# Altium project RFID_PCB_Antenna.PrjPcb
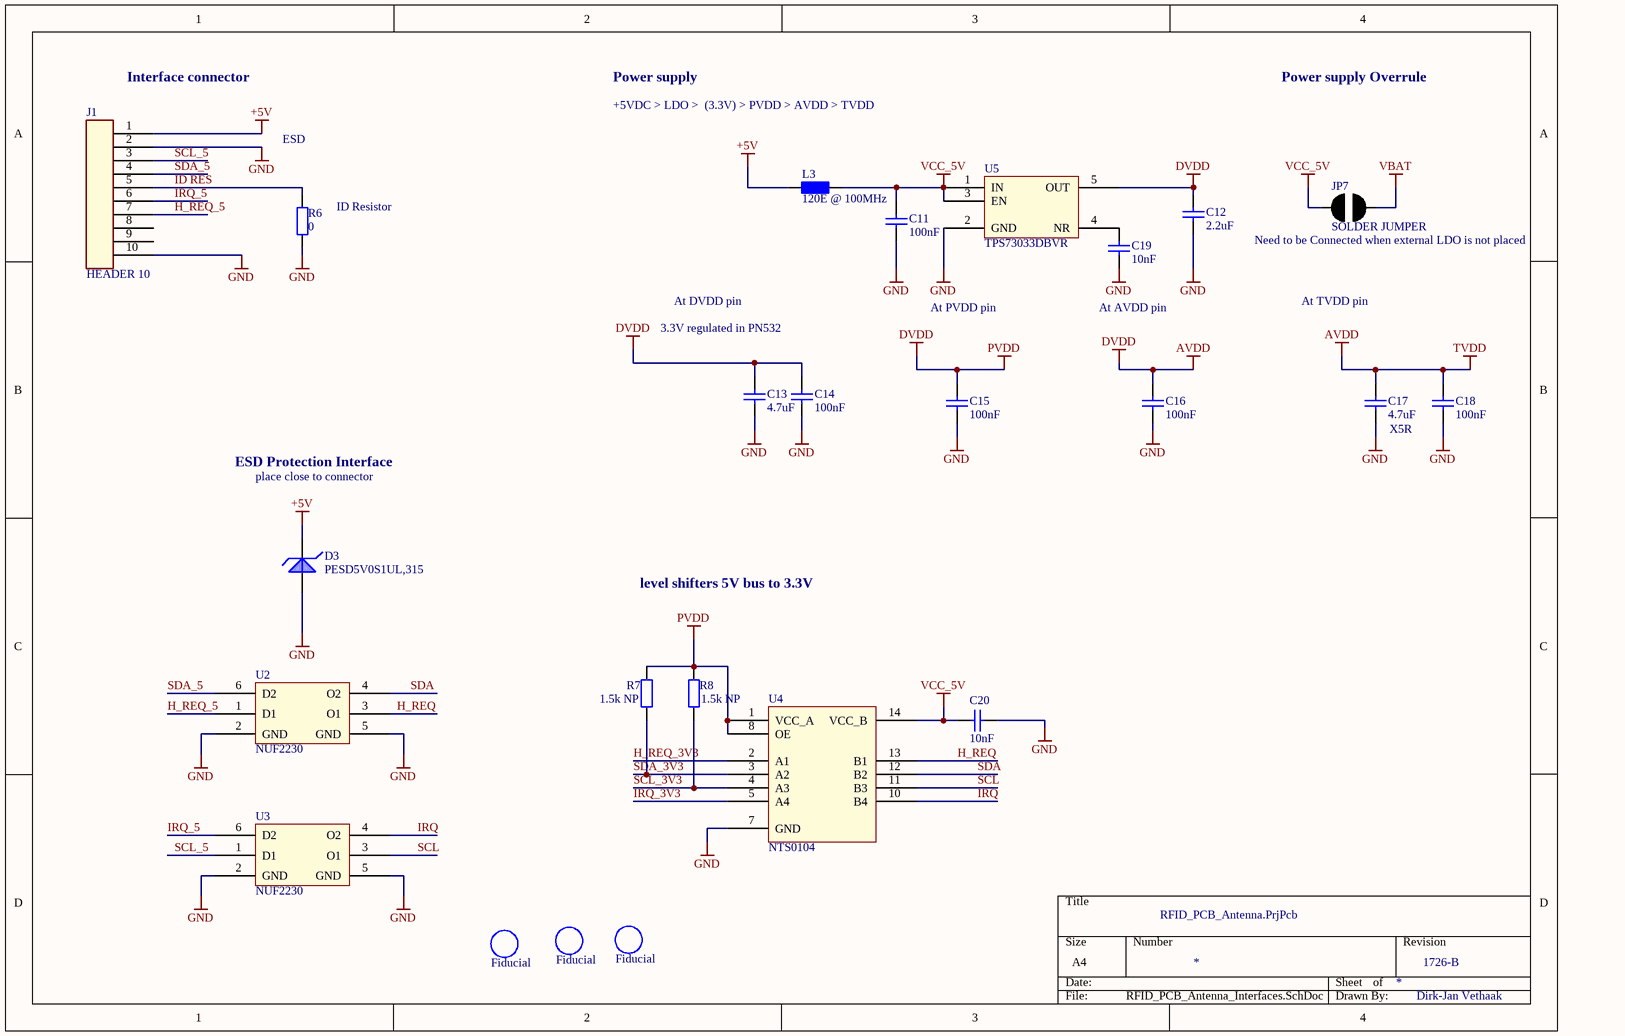
[diagram p0: RFID_PCB_Antenna_Interfaces.SchDoc]
Rev: 1726-B; Sub-Rev: 03; Title: RFID_PCB_Antenna
3 sheets, 65 parts. Net scope: global (net labels, ports and power ports of the same name join across sheets).
Board file: RFID_PCB_Antenna.PcbDoc
Sheets:
  RFID_PCB_Antenna_Interfaces.SchDoc
  RFID_PCB_Antenna_Main_circuit.SchDoc
  RFID_PCB_Antenna_Revisions.SchDoc

## Sheet RFID_PCB_Antenna_Interfaces.SchDoc: RFID_PCB_Antenna
size A4

### Parts
C11  100nF  [cap0402]
C12  2.2uF  [cap0402]
C13  4.7uF  [cap0402]
C14  100nF  [cap0402]
C15  100nF  [cap0402]
C16  100nF  [cap0402]
C17  4.7uF  [cap0402]
C18  100nF  [cap0402]
C19  10nF  [cap0402]
C20  10nF  [cap0402]
D3  Manufacturer Part Number: PESD5V0S1UL,315  [DFN65P100X50-2N]  (hidden comment: PESD5V0S1UL)
Fid1  Fiducial  [Fiducial]  (no BOM)
Fid2  Fiducial  [Fiducial]  (no BOM)
Fid3  Fiducial  [Fiducial]  (no BOM)
J1  HEADER 10  [HEADER-2X5P-ST-2]
JP7  SOLDER JUMPER  [Jumper Solder 0402]
L3  120E @ 100MHz  [R0603]
R6  0  [RESC1105X04N]
R7  1.5k NP  [RESC1105X04N]
R8  1.5k NP  [RESC1105X04N]
U2  NUF2230  [SOTFL50P160X60-6N]
U3  NUF2230  [SOTFL50P160X60-6N]
U4  NTS0104  [QFN50P300X250X100_HS-15N]
U5  TPS73033DBVR  [SOT95P280X145-5N]

### Nets
+5V: D3.1(K) J1.1 L3.1
AVDD: C12.2 C13.2 C14.2 C15.2 C16.2 C17.2 C18.2 R7.2 R8.2 U4.1(VCC_A) U4.8(OE) U5.5(OUT)  [also labelled DVDD, PVDD, TVDD]
GND: C11.1 C12.1 C13.1 C14.1 C15.1 C16.1 C17.1 C18.1 C19.2 C20.1 D3.2(A) J1.2 J1.10 R6.1 U2.2(GND) U2.5(GND) U3.2(GND) U3.5(GND) U4.7(GND) U5.2(GND)
VBAT: JP7.2
VCC_5V: C11.2 C20.2 JP7.1 L3.2 U4.14(VCC_B) U5.1(IN) U5.3(EN)
H_REQ: U2.3(O1) U4.13(B1)
H_REQ_3V3: U4.2(A1)
H_REQ_5: J1.7 U2.1(D1)
ID RES: J1.5 R6.2
IRQ: U3.4(O2) U4.10(B4)
IRQ_3V3: U4.5(A4)
IRQ_5: J1.6 U3.6(D2)
SCL: U3.3(O1) U4.11(B3)
SCL_3V3: R8.1 U4.4(A3)
SCL_5: J1.3 U3.1(D1)
SDA: U2.4(O2) U4.12(B2)
SDA_3V3: R7.1 U4.3(A2)
SDA_5: J1.4 U2.6(D2)
NetC19_1: C19.1 U5.4(NR)

Not connected (* = marked no-connect by the designer): J1 8 9; U4 6(NC) 9(NC)

### Notes on the sheet
- (near J1) Interface connector
- +5VDC > LDO >  (3.3V) > PVDD > AVDD > TVDD
- Power supply
- Power supply Overrule
- ESD
- (near R6) ID Resistor
- (near JP7) Need to be Connected when external LDO is not placed
- At DVDD pin
- At PVDD pin
- (near C19) At AVDD pin
- At TVDD pin
- 3.3V regulated in PN532
- (near C17) X5R
- ESD Protection Interface
- place close to connector
- level shifters 5V bus to 3.3V
- Dirk-Jan Vethaak

### Library data of the parts
C11 C14-C16 C18 = C0402: Manufacturer: Vishay / Vitramon; Manufacturer Part Number: VJ0402G104KXQCW1BC; Capacitance: 0.1 uF; Tolerance: 10 %; Type: Ultra Small Commodity MLCCs; Voltage Rating DC: 10 VDC; Dielectric: X5R; Qualification: Commercial; Supplier 1: Mouser; Supplier Part Number 1: 77-VJ0402G104KXQCBC; RoHS: RoHS Compliant; Category: Multilayer Ceramic Capacitors MLCC - SMD/SMT; Stock 1: 26687; Pricing 1: 1=0.100, 50=0.080, 100=0.066, 500=0.047, 1000=0.028, 10000=0.021, 20000=0.019, 50000=0.012, 100000=0.010 (USD); Height: 0.55 mm; Length: 1 mm; Package / Case: 0402 (1005 metric); Packaging: Reel; Product: General Type MLCCs; Series: VJ W1BC; Termination Style: SMD/SMT; Voltage Rating AC: -; Width: 0.5 mm; Brand: Vishay / Vitramon; Case Code - in: 0402; Case Code - mm: 1005; Maximum Operating Temperature: + 85 C; Minimum Operating Temperature: - 55 C; Product Category: Ceramic Chip Capacitors; RoHS - Mouser: Y; Minimum Order Quantity: 1; Reeling: True; ComponentLink1URL: http://www.mouser.com/ds/2/427/vjw1bcbascomseries-223529.pdf; ComponentLink1Description: http://www.mouser.com/ds/2/427/vjw1bcbascomseries-223529.pdf
C12 = C0402: Manufacturer: Murata Electronics; Manufacturer Part Number: GRM155R61A225KE95D; Tolerance: 10 %; Type: Voltage and Temperature Derating Recommended Product; Voltage Rating DC: 10 VDC; Dielectric: X5R; Product Status: New Product; Supplier 1: Mouser; Supplier Part Number 1: 81-GRM155R61A225KE5D; RoHS: RoHS Compliant; Category: Multilayer Ceramic Capacitors MLCC - SMD/SMT; Stock 1: 204336; Pricing 1: 1=0.120, 10=0.047, 100=0.028, 1000=0.022, 2500=0.018, 10000=0.016, 20000=0.014, 50000=0.013, 100000=0.010 (USD); Capacitance: 2.2 uF; Height: 0.5 mm; Length: 1 mm; Package / Case: 0402 (1005 metric); Packaging: Reel; Product: General Type MLCCs; Series: GRM; Termination Style: SMD/SMT; Width: 0.5 mm; Brand: Murata Electronics; Case Code - in: 0402; Case Code - mm: 1005; Maximum Operating Temperature: + 85 C; Minimum Operating Temperature: - 55 C; RoHS - Mouser: Y; Minimum Order Quantity: 1; Reeling: True; ComponentLink1URL: http://www.mouser.com/ds/2/281/c02e-2905.pdf; ComponentLink1Description: http://www.mouser.com/ds/2/281/c02e-2905.pdf
C13 C17 = C0402: Manufacturer: Murata Electronics; Manufacturer Part Number: GRM155R60J475ME87D; Tolerance: 20 %; Type: Voltage and Temperature Derating Recommended Product; Voltage Rating DC: 6.3 VDC; Dielectric: X5R; Product Status: New at Mouser; Supplier 1: Mouser; Supplier Part Number 1: 81-GRM155R60J475ME8D; RoHS: RoHS Compliant; Category: Multilayer Ceramic Capacitors MLCC - SMD/SMT; Stock 1: 373257; Pricing 1: 1=0.140, 10=0.056, 100=0.033, 1000=0.027, 2500=0.023, 10000=0.020, 20000=0.018, 50000=0.017, 100000=0.014 (USD); Capacitance: 4.7 uF; Height: 0.5 mm; Length: 1 mm; Package / Case: 0402 (1005 metric); Packaging: Reel; Product: General Type MLCCs; Series: GRM15; Termination Style: SMD/SMT; Width: 0.5 mm; Brand: Murata Electronics; Case Code - in: 0402; Case Code - mm: 1005; Maximum Operating Temperature: + 85 C; Minimum Operating Temperature: - 55 C; RoHS - Mouser: Y; Minimum Order Quantity: 1; Reeling: True; ComponentLink1URL: http://www.mouser.com/ds/2/281/c02e-2905.pdf; ComponentLink1Description: http://www.mouser.com/ds/2/281/c02e-2905.pdf
C19 C20 = C0402: Manufacturer: Vishay / Vitramon; Manufacturer Part Number: VJ0402Y103KXJCW1BC; Capacitance: 0.01 uF; Tolerance: 10 %; Type: Ultra Small Commodity MLCCs; Voltage Rating DC: 16 VDC; Dielectric: X7R; Qualification: Commercial; Supplier 1: Mouser; Supplier Part Number 1: 77-VJ0402Y103KXJCBC; RoHS: RoHS Compliant; Category: Multilayer Ceramic Capacitors MLCC - SMD/SMT; Stock 1: 46396; Pricing 1: 1=0.060, 50=0.050, 100=0.040, 500=0.030, 1000=0.025, 10000=0.007, 20000=0.006, 50000=0.005, 100000=0.004 (USD); Height: 0.55 mm; Length: 1 mm; Package / Case: 0402 (1005 metric); Packaging: Reel; Product: General Type MLCCs; Series: VJ W1BC; Termination Style: SMD/SMT; Voltage Rating AC: -; Width: 0.5 mm; Brand: Vishay / Vitramon; Case Code - in: 0402; Case Code - mm: 1005; Maximum Operating Temperature: + 125 C; Minimum Operating Temperature: - 55 C; Product Category: Ceramic Chip Capacitors; RoHS - Mouser: Y; Minimum Order Quantity: 1; Reeling: True; ComponentLink1URL: http://www.mouser.com/ds/2/427/vjw1bcbascomseries-223529.pdf; ComponentLink1Description: http://www.mouser.com/ds/2/427/vjw1bcbascomseries-223529.pdf
D3 = TVS Diode: TVS DIODE 5VWM 20VC SOD882; Manufacturer: NXP Semiconductors; Type: Zener; Unidirectional Channels: 1; Voltage - Reverse Standoff (Typ): 5V (Max); Voltage - Breakdown (Min): 6.4V; Voltage - Clamping (Max) @ Ipp: 20V; Current - Peak Pulse (10/1000µs): 15A (8/20µs); Power - Peak Pulse: 150W; Power Line Protection: No; Capacitance @ Frequency: 152pF @ 1MHz; Supplier 1: Digi-Key; RoHS: RoHS Compliant; Category: Circuit Protection; Stock 1: 10194; Pricing 1: 1=0.37, 10=0.278, 100=0.1732, 500=0.11838, 1000=0.091 (EUR); Packaging: Cut Tape (CT); Bidirectional Channels: -; Applications: Automotive; Operating Temperature: -65°C ~ 150°C (TA); Mounting Type: Surface Mount; Package / Case: SOD-882; Supplier Device Package: SOD-882; ComponentLink1URL: http://www.nxp.com/documents/data_sheet/PESDXS1UL_SER.pdf; ComponentLink1Description: http://www.nxp.com/documents/data_sheet/PESDXS1UL_SER.pdf; Supplier Part Number 1: 568-4802-1-ND
Fid1-Fid3 = Fiducial: ID: Library_MISC-0003; Faber ItemCode: -; Mfg: -; Mfg code: -; Value: Fiducial
J1 = HEADER 10: B10B-PHDSS(LF)(SN); Manufacturer: JST Sales America Inc.; Connector Type: Header, Shrouded; Number of Positions: 10; Number of Positions Loaded: All; Pitch: 0.079" (2.00mm); Supplier 1: Digi-Key; Manufacturer Part Number: B10B-PHDSS(LF)(SN); RoHS: RoHS Compliant; Category: Connectors, Interconnects; Stock 1: 19877; Pricing 1: 1=0.44, 10=0.418, 100=0.2924, 500=0.25058, 1000=0.20882, 5000=0.17899, 10000=0.16706 (EUR); Packaging: Bulk; Contact Type: Male Pin; Number of Rows: 2; Row Spacing: 0.079" (2.00mm); Contact Mating Length: 0.114" (2.90mm); Mounting Type: Through Hole; Termination: Solder; Fastening Type: Detent Lock; Features: -; Contact Finish: Tin; Contact Finish Thickness: -; Color: Natural; ComponentLink1URL: http://www.jst-mfg.com/product/pdf/eng/ePHD.pdf; ComponentLink1Description: http://www.jst-mfg.com/product/pdf/eng/ePHD.pdf; Supplier Part Number 1: 455-1762-ND
JP7 = JUMPER 2 SOLDER: ID: Library_CON-0010; Mfg: -; Mfg code: -; Value: SOLDER JUMPER
L3 = Ferriet Bead 120E: FERRIET BLM18PG121SN1D 0603 MURATA; Manufacturer: Murata Electronics North America; Info: Resistor; Filter Type: Power Line; Number of Lines: 1; Impedance @ Frequency: 120 Ohm @ 100MHz; Current Rating (Max): 2A; DC Resistance (DCR) (Max): 50 mOhm; ID: -; Faber ItemCode: -; Value: 120E @ 100MHz; Mfg: Murata; Mfg code: BLM18PG121SN1D; Supplier 1: Farnell; Supplier 2: Digi-Key; Manufacturer Part Number: BLM18PG121SN1D; RoHS: RoHS Compliant; Category: Filters; Stock 2: 360000; Pricing 2: 4000=0.02022, 8000=0.01832, 12000=0.01769, 28000=0.01642, 100000=0.01623 (EUR); Packaging: Tape & Reel (TR); Ratings: -; Operating Temperature: -55°C ~ 125°C; Package / Case: 0603 (1608 Metric); Mounting Type: Surface Mount; Height (Max): 0.037" (0.95mm); Size / Dimension: 0.063" L x 0.031" W (1.60mm x 0.80mm); ComponentLink1URL: http://search.murata.co.jp/Ceramy/image/img/PDF/ENG/L0110S0100BLM18P.pdf; ComponentLink1Description: http://search.murata.co.jp/Ceramy/image/img/PDF/ENG/L0110S0100BLM18P.pdf; Supplier Part Number 1: 1515738; Supplier Part Number 2: 490-1037-2-ND
R6 = R0402: Manufacturer: VISHAY; Manufacturer Part Number: CRCW04020000Z0ED; Product Range: AEC-Q200 CRCW Series; Voltage Rating: 50; Resistor Case Style: 0402 [1005 Metric]; Power Rating: 63; Resistor Element Material: Thick Film; Temperature Coefficient: ± 100; Resistor Mounting: Surface Mount Device<!--FANDB--><div class="features-and-benefits-container"><div class="features-and-benefits-description"><span class="features-benefits-value">The Vishay D/CRCW e3 series are standard thick film chip resistors. The resistance range includes E96 and E24 decade values from 1ohm to 10Mohm. CRCW e3 series resistors have a pure tin solder contacts on the Ni barrier layer that provides compatibility with reflow soldering process.</span></div><div class="features-and-benefits-list"><ul class="features-and-benefits-list-list"><li class="features-and-benefits-list-item">Automotive grade AEC-Q200 qualified</li><li class="features-and-benefits-list-item">EIA 0402, 0603, 0805, 1206, 1210, 1218, 2010, 2512 standard case sizes available</li><li class="features-and-benefits-list-item">Stability &Delta; Supplier 1: Farnell; Supplier Part Number 1: 1469661; RoHS: Y-EX; Stock 1: 83830; Pricing 1: 10=0.0078, 300=0.0062, 1000=0.0045, 2500=0.0039, 5000=0.0031 (GBP); Resistance: 0; Resistance Tolerance: -; Packaging: Cut Tape; MSL: MSL 1 - Unlimited; ComponentLink1URL: http://www.farnell.com/datasheets/2045673.pdf; ComponentLink1Description: http://www.farnell.com/datasheets/2045673.pdf; ComponentLink2URL: http://www.farnell.com/cad/1551206.zip; ComponentLink2Description: http://www.farnell.com/cad/1551206.zip
R7 R8 = R0402: Manufacturer: Vishay Dale; Manufacturer Part Number: CRCW04021K50JNED; Tolerance: ±5%; Power (Watts): 0.063W, 1/16W; Temperature Coefficient: ±200ppm/°C; Supplier 1: Digi-Key; Supplier Part Number 1: 541-1.5KJCT-ND; RoHS: RoHS Compliant; Category: Resistors; Stock 1: 23738; Pricing 1: 1=0.09, 10=0.019, 25=0.014, 50=0.011, 100=0.008, 250=0.00612, 500=0.0049, 1000=0.0036, 2500=0.00313 (EUR); Packaging: Cut Tape (CT); Resistance (Ohms): 1.5k; Composition: Thick Film; Features: Automotive AEC-Q200; Operating Temperature: -55°C ~ 155°C; Package / Case: 0402 (1005 Metric); Supplier Device Package: 0402 (1005 Metric); Size / Dimension: 0.039" L x 0.020" W (1.00mm x 0.50mm); Height: 0.016" (0.40mm); Number of Terminations: 2; ComponentLink1URL: http://www.vishay.com/docs/20035/dcrcwe3.pdf; ComponentLink1Description: http://www.vishay.com/docs/20035/dcrcwe3.pdf
U2 U3 = NUF2230: NUF2230XV6T1G; Mfg: ON Semiconductor; Filter Order: 2nd; Number of Channels: 2; Center / Cutoff Frequency: 125MHz (Cutoff); Attenuation Value: 30dB @ 800MHz ~ 900MHz; Resistance - Channel (Ohms): 100; Values: R = 100 Ohms, C = 16pF; ESD Protection: Yes; Supplier 1: Digi-Key; Supplier Part Number 1: NUF2230XV6T1GOSCT-ND; Mfg code: NUF2230XV6T1G; RoHS: RoHS Compliant; Category: Filters; Stock: 3048; Pricing: 1=0.27, 10=0.252, 25=0.2404, 50=0.2326, 100=0.2248, 250=0.21316, 500=0.17828, 1000=0.13836 (EUR); Packaging: Cut Tape (CT); Type: Low Pass; Technology: RC (Pi); Current: -; Operating Temperature: -40°C ~ 85°C; Applications: Data Lines for Mobile Devices; Package / Case: SOT-563, SOT-666; Size / Dimension: 0.063" L x 0.047" W (1.60mm x 1.20mm); Height: 0.024" (0.60mm); ComponentLink1URL: http://www.onsemi.com/pub_link/Collateral/NUF2230XV6-D.PDF; ComponentLink1Description: http://www.onsemi.com/pub_link/Collateral/NUF2230XV6-D.PDF; Manufacturer Part Number: NUF2230XV6T1G; Manufacturer: ON Semiconductor
U4 = NTS0104: NTS0104BQ,115, DHVQFN14; Manufacturer: NXP Semiconductors; Translator Type: Voltage Level; Channel Type: Bidirectional; Number of Circuits: 1; Channels per Circuit: 4; Voltage - VCCA: 1.65 V ~ 3.6 V; Voltage - VCCB: 2.3 V ~ 5.5 V; Output Type: Open Drain, Push-Pull; Data Rate: 50Mbps; Supplier 1: Digi-Key; Manufacturer Part Number: NTS0104BQ,115; RoHS: RoHS Compliant; Category: Integrated Circuits (ICs); Stock 1: 6000; Pricing 1: 3000=0.33105, 6000=0.3145, 15000=0.30267, 30000=0.29322, 75000=0.28376 (EUR); Packaging: Tape & Reel (TR); Input Signal: -; Output Signal: -; Operating Temperature: -40°C ~ 125°C (TA); Features: Auto-Direction Sensing; Mounting Type: Surface Mount; Package / Case: 14-VFQFN Exposed Pad; Supplier Device Package: 14-DHVQFN (2.5x3); ComponentLink1URL: http://www.nxp.com/documents/data_sheet/NTS0104.pdf; ComponentLink1Description: http://www.nxp.com/documents/data_sheet/NTS0104.pdf; Supplier Part Number 1: 568-8407-2-ND
U5 = TPS73033DBVR: LDO 3.3V; Manufacturer: Texas Instruments; Regulator Topology: Positive Fixed; Current - Output: 200mA; Voltage - Dropout (Typical): 0.12V @ 200mA; Number of Regulators: 1; Voltage - Input: Up to 5.5V; Current - Limit (Min): 285mA; Supplier 1: Digi-Key; Manufacturer Part Number: TPS73033DBVR; RoHS: RoHS Compliant; Category: Integrated Circuits (ICs); Stock 1: 21892; Pricing 1: 1=0.6, 10=0.528, 100=0.4043, 500=0.32032, 1000=0.25657 (EUR); Packaging: Cut Tape (CT); Voltage - Output: 3.3V; Operating Temperature: -40°C ~ 125°C; Mounting Type: Surface Mount; Package / Case: SC-74A, SOT-753; Supplier Device Package: SOT-23-5; ComponentLink1URL: http://www.ti.com/lit/ds/symlink/tps730.pdf; ComponentLink1Description: http://www.ti.com/lit/ds/symlink/tps730.pdf

## Sheet RFID_PCB_Antenna_Main_circuit.SchDoc: RFID_PCB_Antenna
size A4; PageSetup: Record=PageOptions|CenterHorizontal=True|CenterVertical=True|PrintScale=0.97|XCorrection=1.00|YCorrection=1.00|PrintKind=0|BorderSize=5000000|LeftOffset=0|BottomOffset=0|Orientation=2|PaperLength=1000|PaperWidth=1000|Scale=100|PaperSource=15|PrintQuality=-3|MediaType=1|DitherType=10|PrintScaleMode=1|PaperKind=A4|PaperIndex=9
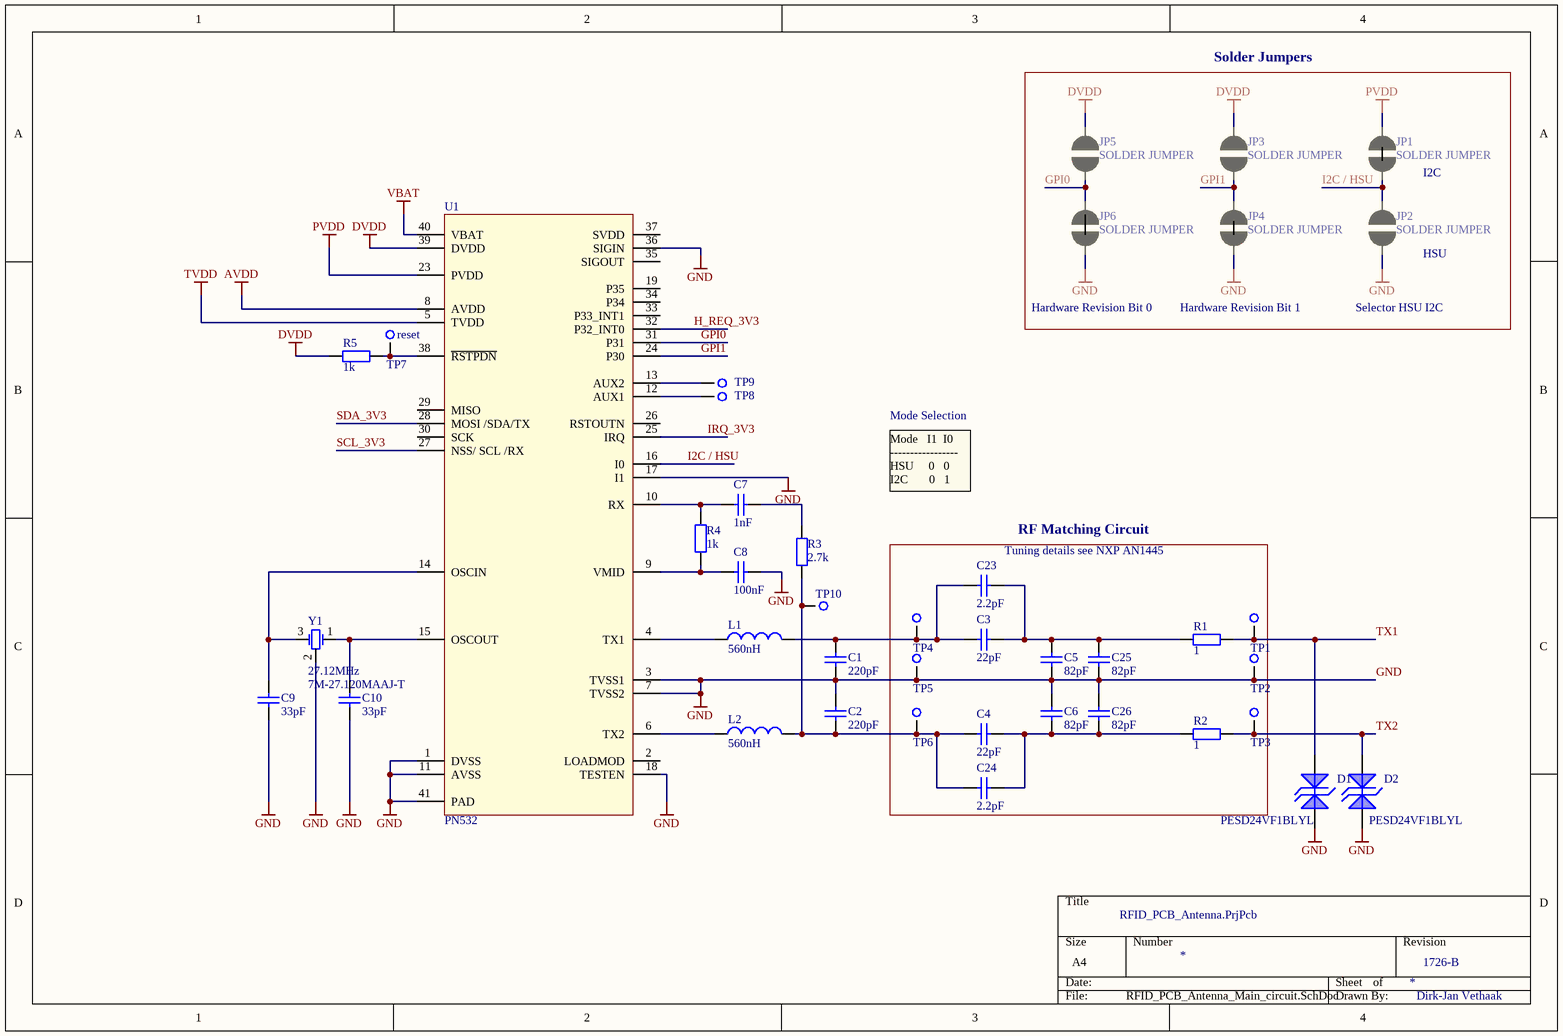
[diagram p1: RFID_PCB_Antenna_Main_circuit.SchDoc]

### Parts
C1  220pF  [cap0402]
C2  220pF  [cap0402]
C3  22pF  [cap0402]
C4  22pF  [cap0402]
C5  82pF  [cap0402]
C6  82pF  [cap0402]
C7  1nF  [cap0402]
C8  100nF  [cap0402]
C9  33pF  [cap0402]
C10  33pF  [cap0402]
C23  2.2pF  [cap0402]
C24  2.2pF  [cap0402]
C25  82pF  [cap0402]
C26  82pF  [cap0402]
D1  Manufacturer Part Number: PESD24VF1BLYL  [DFN65P100X50-2N]  (hidden comment: PESD24VF1BL)
D2  Manufacturer Part Number: PESD24VF1BLYL  [DFN65P100X50-2N]  (hidden comment: PESD24VF1BL)
JP1  SOLDER JUMPER  [Jumper Solder 0402]
JP2  SOLDER JUMPER  [Jumper Solder 0402]
JP3  SOLDER JUMPER  [Jumper Solder 0402]
JP4  SOLDER JUMPER  [Jumper Solder 0402]
JP5  SOLDER JUMPER  [Jumper Solder 0402]
JP6  SOLDER JUMPER  [Jumper Solder 0402]
L1  560nH  [C0603]
L2  560nH  [C0603]
R1  1  [RESC1105X04N]
R2  1  [RESC1105X04N]
R3  2.7k  [RESC1105X04N]
R4  1k  [RESC1105X04N]
R5  1k  [RESC1105X04N]
TP1  Testpoint  [Testpoint]  (value not drawn)
TP2  Testpoint  [Testpoint]  (value not drawn)
TP3  Testpoint  [Testpoint]  (value not drawn)
TP4  Testpoint  [Testpoint]  (value not drawn)
TP5  Testpoint  [Testpoint]  (value not drawn)
TP6  Testpoint  [Testpoint]  (value not drawn)
TP7  Testpoint  [TESTPOINT]  (value not drawn)
TP8  Testpoint  [Testpoint]  (value not drawn)
TP9  Testpoint  [Testpoint]  (value not drawn)
TP10  Testpoint  [Testpoint]  (value not drawn)
U1  PN532  [QFN50P600X600X100_HS-41N]
Y1  27.12MHz  [DFN170P250X71-4N]

### Blocks framed on the sheet
Solder Jumpers: JP1-JP6
RF Matching Circuit: C3-C6 C23-C26 R1 R2 TP1-TP6

### Nets
AVDD: JP1.2 JP3.2 JP5.2 R5.2 U1.5(TVDD) U1.8(AVDD) U1.23(PVDD) U1.39(DVDD)  [also labelled DVDD, PVDD, TVDD]
GND: C1.1 C2.2 C5.1 C6.2 C8.1 C9.1 C10.1 C25.1 C26.2 D1.1(K1) D2.1(K1) JP2.1 JP4.1 JP6.1 TP2.1 TP5.1 U1.1(DVSS) U1.3(TVSS1) U1.7(TVSS2) U1.11(AVSS) U1.17(I1) U1.18(TESTEN) U1.36(SIGIN) U1.41(PAD) Y1.2
VBAT: U1.40(VBAT)
GPI0: JP5.1 JP6.2 U1.31(P31)
GPI1: JP3.1 JP4.2 U1.24(P30)
H_REQ_3V3: U1.32(P32_INT0)
I2C / HSU: JP1.1 JP2.2 U1.16(I0)
IRQ_3V3: U1.25(IRQ)
SCL_3V3: U1.27(NSS/_SCL_/RX)
SDA_3V3: U1.28(MOSI_/SDA/TX)
TX1: D1.2(K2) R1.2 TP1.1
TX2: D2.2(K2) R2.2 TP3.1
NetC1_2: C1.2 C3.1 C23.1 L1.2 TP4.1
NetC2_1: C2.1 C4.1 C24.1 L2.2 R3.1 TP6.1 TP10.1
NetC3_2: C3.2 C5.2 C23.2 C25.2 R1.1
NetC4_2: C4.2 C6.1 C24.2 C26.1 R2.1
NetC7_1: C7.1 R4.2 U1.10(RX)
NetC7_2: C7.2 R3.2
NetC8_2: C8.2 R4.1 U1.9(VMID)
NetC9_2: C9.2 U1.14(OSCIN) Y1.3
NetC10_2: C10.2 U1.15(OSCOUT) Y1.1
NetL1_1: L1.1 U1.4(TX1)
NetL2_1: L2.1 U1.6(TX2)
NetR5_1: R5.1 TP7.1 U1.38(~{RSTPDN})
NetTP8_1: TP8.1 U1.12(AUX1)
NetTP9_1: TP9.1 U1.13(AUX2)

Not connected (* = marked no-connect by the designer): U1 2(LOADMOD) 19(P35) 20(NC) 21(NC) 22(NC) 26(RSTOUTN) 29(MISO) 30(SCK) 33(P33_INT1) 34(P34) 35(SIGOUT) 37(SVDD)

### Notes on the sheet
- I2C
- Hardware Revision Bit 0
- Hardware Revision Bit 1
- Selector HSU I2C
- (near JP2) HSU
- (near TP7) reset
- Mode Selection
- Mode   I1  I0
  -----------------
  HSU     0   0
  I2C       0   1
- (near C23) Tuning details see NXP AN1445
- Dirk-Jan Vethaak

### Library data of the parts
C1 C2 = C0402: Manufacturer: Murata Electronics North America; Manufacturer Part Number: GRM1555C1H221JA01D; Tolerance: ±5%; Voltage - Rated: 50V; Temperature Coefficient: C0G, NP0; Supplier 1: Digi-Key; Supplier Part Number 1: 490-1293-2-ND; RoHS: RoHS Compliant; Category: Capacitors; Stock 1: 650000; Pricing 1: 10000=0.00442, 20000=0.00421, 30000=0.004, 50000=0.00358, 100000=0.00289 (EUR); Packaging: Tape & Reel (TR); Capacitance: 220pF; Mounting Type: Surface Mount, MLCC; Operating Temperature: -55°C ~ 125°C; Applications: General Purpose; Ratings: -; Package / Case: 0402 (1005 Metric); Size / Dimension: 0.039" L x 0.020" W (1.00mm x 0.50mm); Height - Seated (Max): -; Thickness (Max): 0.022" (0.55mm); Lead Spacing: -; Features: -; Lead Style: -; ComponentLink1URL: http://www.murata.com/~/media/webrenewal/support/library/catalog/products/capacitor/mlcc/c02e.pdf; ComponentLink1Description: http://www.murata.com/~/media/webrenewal/support/library/catalog/products/capacitor/mlcc/c02e.pdf
C3 C4 = C0402: Manufacturer: Murata Electronics North America; Manufacturer Part Number: GRM1555C1H220FA01D; Tolerance: ±1%; Voltage - Rated: 50V; Temperature Coefficient: C0G, NP0; Supplier 1: Digi-Key; Supplier Part Number 1: 490-8589-2-ND; RoHS: RoHS Compliant; Category: Capacitors; Stock 1: 150000; Pricing 1: 10000=0.00677, 20000=0.00645, 30000=0.00613, 50000=0.00548, 100000=0.00443 (EUR); Packaging: Tape & Reel (TR); Capacitance: 22pF; Mounting Type: Surface Mount, MLCC; Operating Temperature: -55°C ~ 125°C; Applications: General Purpose; Ratings: -; Package / Case: 0402 (1005 Metric); Size / Dimension: 0.039" L x 0.020" W (1.00mm x 0.50mm); Height - Seated (Max): -; Thickness (Max): 0.022" (0.55mm); Lead Spacing: -; Features: -; Lead Style: -; ComponentLink1URL: http://www.murata.com/~/media/webrenewal/support/library/catalog/products/capacitor/mlcc/c02e.pdf; ComponentLink1Description: http://www.murata.com/~/media/webrenewal/support/library/catalog/products/capacitor/mlcc/c02e.pdf
C5 C6 C25 C26 = C0402: Manufacturer: AVX; Manufacturer Part Number: 04025A820FAT2A; Capacitance: 82; Capacitance Tolerance: ± 1%; Dielectric Characteristic: C0G / NP0; Voltage Rating: 50; Ceramic Capacitor Case: 0402 [1005 Metric]; SVHC: No SVHC (17-Dec-2015); Capacitor Terminals: SMD; External Depth: 0.5; External Length / Height: 0.25; External Width: 1; No. of Pins: 2; Temperature Coefficient: 0ppm/°C ± 30ppm/°C<!--FANDB--><div class="features-and-benefits-container"><div class="features-and-benefits-description"><span class="features-benefits-value">The AVX multilayer ceramic capacitors with EIA class I, C0G (NP0) dielectric material are highly stable ceramic chip capacitors for general purpose applications. This multilayer ceramic capacitor is a monolithic block of ceramic containing two sets of offset, interleaved planar electrodes that extend to two opposite surfaces of ceramic dielectric.</span></div><div class="features-and-benefits-list"><ul class="features-and-benefits-list-list"><li class="features-and-benefits-list-item">Capacitance value ranges from 0.5pF to 0.1?F</li><li class="features-and-benefits-list-item">EIA 0101, 0201, 0402, 0603, 0805, 1206, 1210, 1812, 1825, 2220, 2225 case sizes available</li><li class="features-and-benefits-list-item">Rated DC voltage of 6.3V, 10V, 16V, 25V, 50V, 100V, 200V, 500V</li><li class="features-and-benefits-list-item">±0.10pF, ±0.25pF, ±0.50pF, ±1%, ±2%, ±5% and ±10% tolerance</li><li class="features-and-benefits-list-item">Nickel (Ni) and tin (Sn) plated terminations</li><li class="features-and-benefits-list-item">Load life of 1000h at 125?C</li><li class="features-and-benefits-list-item">Operating temperature range -55?C to 125; Supplier 1: Farnell; Supplier Part Number 1: 1740575; RoHS: YES; Stock 1: 22436; Pricing 1: 10=0.379, 100=0.076, 500=0.038, 2500=0.0228, 5000=0.019, 10000=0.0163, 50000=0.0143, 100000=0.0127 (GBP); Product Range: -; Operating Temperature Min: -55; Operating Temperature Max: 125; Packaging: Cut Tape; MSL: MSL 1 - Unlimited; Capacitance Tolerance ±: ± 1%; Operating Temperature Range: -55°C to +125; ComponentLink1URL: http://www.farnell.com/datasheets/425357.pdf; ComponentLink1Description: http://www.farnell.com/datasheets/425357.pdf
C7 = C0402: Manufacturer: Vishay / Vitramon; Manufacturer Part Number: VJ0402Y102KXAAC; Capacitance: 1000 pF; Tolerance: 10 %; Type: Commercial SMD MLCCs; Voltage Rating DC: 50 VDC; Dielectric: X7R; Qualification: Commercial; Supplier 1: Mouser; Supplier Part Number 1: 77-VJ0402Y102KXAAC; RoHS: RoHS Compliant; Category: Multilayer Ceramic Capacitors MLCC - SMD/SMT; Stock 1: 19151; Pricing 1: 1=0.060, 50=0.050, 100=0.044, 500=0.043, 5000=0.043 (USD); Height: 0.6 mm; Length: 1 mm; Package / Case: 0402 (1005 metric); Packaging: Reel; Product: General Type MLCCs; Series: VJ COMM; Termination Style: SMD/SMT; Voltage Rating AC: -; Width: 0.5 mm; Brand: Vishay / Vitramon; Case Code - in: 0402; Case Code - mm: 1005; Maximum Operating Temperature: + 125 C; Minimum Operating Temperature: - 55 C; Product Category: Ceramic Chip Capacitors; RoHS - Mouser: Y; Minimum Order Quantity: 1; Reeling: True; ComponentLink1URL: http://www.mouser.com/ds/2/427/vjcommercialseries-222796.pdf; ComponentLink1Description: http://www.mouser.com/ds/2/427/vjcommercialseries-222796.pdf
C8 = C0402: as C11 on sheet RFID_PCB_Antenna_Interfaces; Supplier 1: Mouser; Supplier Part Number 1: 77-VJ0402G104KXQCBC; RoHS: RoHS Compliant; Category: Multilayer Ceramic Capacitors MLCC - SMD/SMT; Stock 1: 26687; Pricing 1: 1=0.100, 50=0.080, 100=0.066, 500=0.047, 1000=0.028, 10000=0.021, 20000=0.019, 50000=0.012, 100000=0.010 (USD); Height: 0.55 mm; Length: 1 mm; Package / Case: 0402 (1005 metric); Packaging: Reel; Product: General Type MLCCs; Series: VJ W1BC; Termination Style: SMD/SMT; Voltage Rating AC: -; Width: 0.5 mm; Brand: Vishay / Vitramon; Case Code - in: 0402; Case Code - mm: 1005; Maximum Operating Temperature: + 85 C; Minimum Operating Temperature: - 55 C; Product Category: Ceramic Chip Capacitors; RoHS - Mouser: Y; Minimum Order Quantity: 1; Reeling: True; ComponentLink1URL: http://www.mouser.com/ds/2/427/vjw1bcbascomseries-223529.pdf; ComponentLink1Description: http://www.mouser.com/ds/2/427/vjw1bcbascomseries-223529.pdf
C9 C10 = C0402: Manufacturer: MURATA; Manufacturer Part Number: GRM1555C1H330JA01D; Product Range: GRM Series; Capacitance: 33; Capacitance Tolerance: ± 5%; Dielectric Characteristic: C0G / NP0; Voltage Rating: 50; Ceramic Capacitor Case: 0402 [1005 Metric]; SVHC: No SVHC (17-Dec-2015; Supplier 1: Farnell; Supplier Part Number 1: 2434643; RoHS: YES; Stock 1: 32150; Pricing 1: 10=0.0078, 100=0.0064, 500=0.005, 2500=0.0033, 5000=0.0032, 10000=0.0026, 50000=0.002, 100000=0.0019 (GBP); Operating Temperature Min: -55; Operating Temperature Max: 125; Packaging: Cut Tape; MSL: MSL 1 - Unlimited; ComponentLink1URL: http://www.farnell.com/datasheets/2047983.pdf; ComponentLink1Description: http://www.farnell.com/datasheets/2047983.pdf
C23 C24 = C0402: Manufacturer: MURATA; Manufacturer Part Number: GRM1555C1H2R2CA01D; Product Range: GRM Series; Capacitance: 2.2; Capacitance Tolerance: ± 0.25; Dielectric Characteristic: C0G / NP0; Voltage Rating: 50; Ceramic Capacitor Case: 0402 [1005 Metric]; SVHC: No SVHC (17-Dec-2015)<!--FANDB--><div class="features-and-benefits-container"><div class="features-and-benefits-description"><span class="features-benefits-value">The GRM1555C1H2R2CA01D is a Multilayer Ceramic Capacitor for general purpose, C0G/NP0 dielectric and 0402 case. Since the external electrodes consist of a plated structure, the product is excellent in soldering heat resistance. The profile dimensions have been standardized with high precision, therefore high reliability can be acquired in the case of automatic mounting.</span></div><div class="features-and-benefits-list"><ul class="features-and-benefits-list-list"><li class="features-and-benefits-list-item">High reliability with no polarity</li><li class="features-and-benefits-list-item">Low impedance in high frequencies and excellent in pulse response and noise elimination</li></ul></div><div class="features-and-benefits-applications"><ul class="features-and-benefits-value"><li class="features-and-benefits-list-item">Industrial</li></ul></div></div>; Supplier 1: Farnell; Supplier Part Number 1: 2434609; RoHS: YES; Stock 1: 133410; Pricing 1: 10=0.0091, 100=0.0057, 500=0.005, 2500=0.0033, 5000=0.0032, 10000=0.0024, 50000=0.002, 100000=0.0018 (GBP); Operating Temperature Min: -55; Operating Temperature Max: 125; Packaging: Cut Tape; MSL: MSL 1 - Unlimited; ComponentLink1URL: http://www.farnell.com/datasheets/2047874.pdf; ComponentLink1Description: http://www.farnell.com/datasheets/2047874.pdf
D1 D2 = Biploar TVS Diode: TVS DIODE 24VWM 17VC DFN1006-2; Manufacturer: NXP Semiconductors; Type: Zener; Bidirectional Channels: 1; Voltage - Reverse Standoff (Typ): 24V (Max); Voltage - Breakdown (Min): 24.5V; Voltage - Clamping (Max) @ Ipp: 17V; Current - Peak Pulse (10/1000µs): 1A (8/20µs); Power Line Protection: No; Capacitance @ Frequency: 0.3pF @ 1MHz; Supplier 1: Digi-Key; RoHS: RoHS Compliant; Category: Circuit Protection; Stock 1: 30000; Pricing 1: 10000=0.09736, 30000=0.0893, 50000=0.08595, 100000=0.08393, 250000=0.08259 (EUR); Packaging: Tape & Reel (TR); Unidirectional Channels: -; Power - Peak Pulse: -; Applications: Automotive; Operating Temperature: -55°C ~ 150°C (TA); Mounting Type: Surface Mount; Package / Case: SOD-882; Supplier Device Package: SOD-882; ComponentLink1URL: http://www.nxp.com/documents/data_sheet/PESD24VF1BL.pdf; ComponentLink1Description: http://www.nxp.com/documents/data_sheet/PESD24VF1BL.pdf; Supplier Part Number 1: 568-12543-2-ND
JP1-JP6 = JUMPER 2 SOLDER: Manufacturer: VISHAY; Manufacturer Part Number: CRCW04020000Z0ED; ID: Library_CON-0010; Product Range: AEC-Q200 CRCW Series; Resistance: 0; Power Rating: 63; Voltage Rating: 50; Resistor Case Style: 0402 [1005 Metric]; Resistor Element Material: Thick Film; Temperature Coefficient: ± 100; Resistor Mounting: Surface Mount Device<!--FANDB--><div class="features-and-benefits-container"><div class="features-and-benefits-description"><span class="features-benefits-value">The Vishay D/CRCW e3 series are standard thick film chip resistors. The resistance range includes E96 and E24 decade values from 1ohm to 10Mohm. CRCW e3 series resistors have a pure tin solder contacts on the Ni barrier layer that provides compatibility with reflow soldering process.</span></div><div class="features-and-benefits-list"><ul class="features-and-benefits-list-list"><li class="features-and-benefits-list-item">Automotive grade AEC-Q200 qualified</li><li class="features-and-benefits-list-item">EIA 0402, 0603, 0805, 1206, 1210, 1218, 2010, 2512 standard case sizes available</li><li class="features-and-benefits-list-item">Stability &Delta; Mfg: -; Mfg code: -; Value: SOLDER JUMPER; Supplier 1: Farnell; RoHS: Y-EX; Stock 1: 111126; Pricing 1: 10=0.0194, 300=0.0152, 1000=0.0099, 2500=0.0078, 5000=0.0052 (GBP); Resistance Tolerance: -; Packaging: Cut Tape; MSL: MSL 1 - Unlimited; ComponentLink1URL: http://www.farnell.com/datasheets/2045673.pdf; ComponentLink1Description: http://www.farnell.com/datasheets/2045673.pdf; ComponentLink2URL: http://www.farnell.com/cad/1551206.zip; ComponentLink2Description: http://www.farnell.com/cad/1551206.zip
L1 L2 = Inductor: Murata LQW18CNR56J00D 560nH 5%; Manufacturer: Murata Electronics North America; Type: Wirewound; Material - Core: Ferrite; Current Rating: 450mA; Shielding: Unshielded; DC Resistance (DCR): 480 mOhm Max; Frequency - Self Resonant: 540MHz; Frequency - Test: 10MHz; Supplier 1: Digi-Key; Supplier Part Number 1: 490-10774-1-ND; Manufacturer Part Number: LQW18CNR56J00D; RoHS: RoHS Compliant; Category: Inductors, Coils, Chokes; Stock 1: 10277; Pricing 1: 1=0.47, 10=0.415, 25=0.39, 50=0.3376, 100=0.3117, 250=0.29612, 500=0.27014, 750=0.23897, 1000=0.22858 (EUR); Packaging: Cut Tape (CT); Inductance: 560nH; Tolerance: ±5%; Current - Saturation: -; Q @ Freq: -; Ratings: -; Operating Temperature: -40°C ~ 85°C; Mounting Type: Surface Mount; Package / Case: 0603 (1608 Metric); Size / Dimension: 0.063" L x 0.031" W (1.60mm x 0.80mm); Height - Seated (Max): 0.037" (0.95mm); ComponentLink1URL: http://www.murata.com/~/media/webrenewal/support/library/catalog/products/inductor/chip/o05e.ashx; ComponentLink1Description: http://www.murata.com/~/media/webrenewal/support/library/catalog/products/inductor/chip/o05e.ashx
R1 R2 = R0402: Manufacturer: MULTICOMP; Manufacturer Part Number: MCMR04W1R00FTL; Product Range: MCMR Series; Voltage Rating: 50; Resistor Case Style: 0402 [1005 Metric]; Power Rating: 62.5; Resistance Tolerance: ± 1%; Resistor Element Material: Ceramic; Temperature Coefficient: -200ppm/°C to +400; SVHC: No SVHC (17-Dec-2015); Resistor Mounting: Surface Mount Device<!--FANDB--><div class="features-and-benefits-container"><div class="features-and-benefits-description"><span class="features-benefits-value">The Multicomp MCMR series resistors are automotive grade, anti sulphured thick film chip resistor. The resistance range includes E24 and E96 decade values from 1ohm to 10Mohm. These resistors are constructed on top of a high grade ceramic body.</span></div><div class="features-and-benefits-list"><ul class="features-and-benefits-list-list"><li class="features-and-benefits-list-item">EIA 0402, 0603, 0805, 1206 chip sizes available</li><li class="features-and-benefits-list-item">High reliability and stability</li><li class="features-and-benefits-list-item">Automotive grade AEC-Q200 compliant</li><li class="features-and-benefits-list-item">Complaint with (IEC 60068-1) 55/155/56 climatic category</li><li class="features-and-benefits-list-item">Maximum operation voltage of 50V, 75V, 150V and 200V</li><li class="features-and-benefits-list-item">Power rating of 62.5mW, 100mW, 125mW and 250mW</li><li class="features-and-benefits-list-item">Available in ±1% and ±5% tolerance</li><li class="features-and-benefits-list-item">Temperature coefficient (TCR) of +200ppm/°C, +100ppm/°C and -200ppm/°C to +400ppm/°C</li><li class="features-and-benefits-list-item">Operating temperature range -55°C to 155; Supplier 1: Farnell; Supplier Part Number 1: 2072500; RoHS: YES; Stock 1: 17702; Pricing 1: 10=0.0192, 100=0.0151, 500=0.0109, 2500=0.0047, 5000=0.004, 10000=0.0033, 50000=0.0023, 100000=0.002 (GBP); Resistance: 1; Packaging: Cut Tape; MSL: -; ComponentLink1URL: http://www.farnell.com/datasheets/1716705.pdf; ComponentLink1Description: http://www.farnell.com/datasheets/1716705.pdf
R3 = R0402: Manufacturer: Vishay Dale; Manufacturer Part Number: CRCW04022K70FKED; Tolerance: ±1%; Power (Watts): 0.063W, 1/16W; Temperature Coefficient: ±100ppm/°C; Supplier 1: Digi-Key; Supplier Part Number 1: 541-2.70KLTR-ND; RoHS: RoHS Compliant; Category: Resistors; Stock 1: 70000; Pricing 1: 10000=0.00292, 30000=0.00256, 50000=0.00235, 100000=0.0023 (EUR); Packaging: Tape & Reel (TR); Resistance (Ohms): 2.7k; Composition: Thick Film; Features: Automotive AEC-Q200; Operating Temperature: -55°C ~ 155°C; Package / Case: 0402 (1005 Metric); Supplier Device Package: 0402 (1005 Metric); Size / Dimension: 0.039" L x 0.020" W (1.00mm x 0.50mm); Height: 0.016" (0.40mm); Number of Terminations: 2; ComponentLink1URL: http://www.vishay.com/docs/20035/dcrcwe3.pdf; ComponentLink1Description: http://www.vishay.com/docs/20035/dcrcwe3.pdf
R4 R5 = R0402: Manufacturer: Vishay Beyschlag; Manufacturer Part Number: MCS04020C1001FE000; Tolerance: ±1%; Power (Watts): 0.1W, 1/10W; Temperature Coefficient: ±50ppm/°C; Supplier 1: Digi-Key; Supplier Part Number 1: MCS0402-1.00K-CFTR-ND; RoHS: RoHS Compliant; Category: Resistors; Stock 1: 80000; Pricing 1: 10000=0.02474, 30000=0.0235, 50000=0.02302, 100000=0.02253 (EUR); Packaging: Tape & Reel (TR); Resistance (Ohms): 1k; Composition: Thin Film; Features: -; Operating Temperature: -55°C ~ 155°C; Package / Case: 0402 (1005 Metric); Supplier Device Package: 0402; Size / Dimension: 0.039" L x 0.020" W (1.00mm x 0.50mm); Height: 0.015" (0.37mm); Number of Terminations: 2; ComponentLink1URL: http://www.vishay.com/docs/28705/mcx0x0xpro.pdf; ComponentLink1Description: http://www.vishay.com/docs/28705/mcx0x0xpro.pdf
TP1-TP6 TP8-TP10 = Testpoint: ID: Library_MISC-0001; Faber ItemCode: -; Mfg: -; Mfg code: -; Info: Testpoint; Value: Testpoint
TP7 = Testpoint 1mm: ID: Library_MISC-0001; Faber ItemCode: -; Mfg: -; Mfg code: -; Info: Testpoint; Value: Testpoint
U1 = PN532: PN5321A3HN; Manufacturer: NXP; Manufacturer Part Number: PN5321A3HN/C106;55; Supplier 1: Farnell; RoHS: YES; Stock 1: 1123; Pricing 1: 1=8.6, 10=7.23, 100=5.37, 300=5.17, 700=5.08, 2000=4.34, 3000=4.27 (GBP); ComponentLink1URL: http://www.farnell.com/datasheets/1751691.pdf; ComponentLink1Description: http://www.farnell.com/datasheets/1751691.pdf; ComponentLink2URL: http://www.farnell.com/cad/1722221.zip; ComponentLink2Description: http://www.farnell.com/cad/1722221.zip; Supplier Part Number 1: 1902845
Y1 = XTAL-3: 7M-27.120MAAJ-T; Manufacturer: TXC CORPORATION; Frequency Stability: ±30ppm; Load Capacitance: 18pF; ESR (Equivalent Series Resistance): 60 Ohm; Operating Mode: Fundamental; Supplier 1: Digi-Key; RoHS: RoHS Compliant; Category: Crystals and Oscillators; Stock 1: 37105; Pricing 1: 1=0.85, 10=0.748, 50=0.6988, 100=0.6185, 500=0.58444, 1000=0.48858 (EUR); Packaging: Cut Tape (CT); Type: MHz Crystal; Frequency: 27.12MHz; Frequency Tolerance: ±30ppm; Operating Temperature: -20°C ~ 70°C; Ratings: -; Mounting Type: Surface Mount; Package / Case: 4-SMD, No Lead (DFN, LCC); Size / Dimension: 0.126" L x 0.098" W (3.20mm x 2.50mm); Height: 0.031" (0.80mm); ComponentLink1URL: http://www.txccrystal.com/images/pdf/7m.pdf; ComponentLink1Description: http://www.txccrystal.com/images/pdf/7m.pdf; Supplier Part Number 1: 887-1424-1-ND; Manufacturer Part Number: 7M-27.120MAAJ-T

## Sheet RFID_PCB_Antenna_Revisions.SchDoc: RFID_PCB_Antenna
size A4
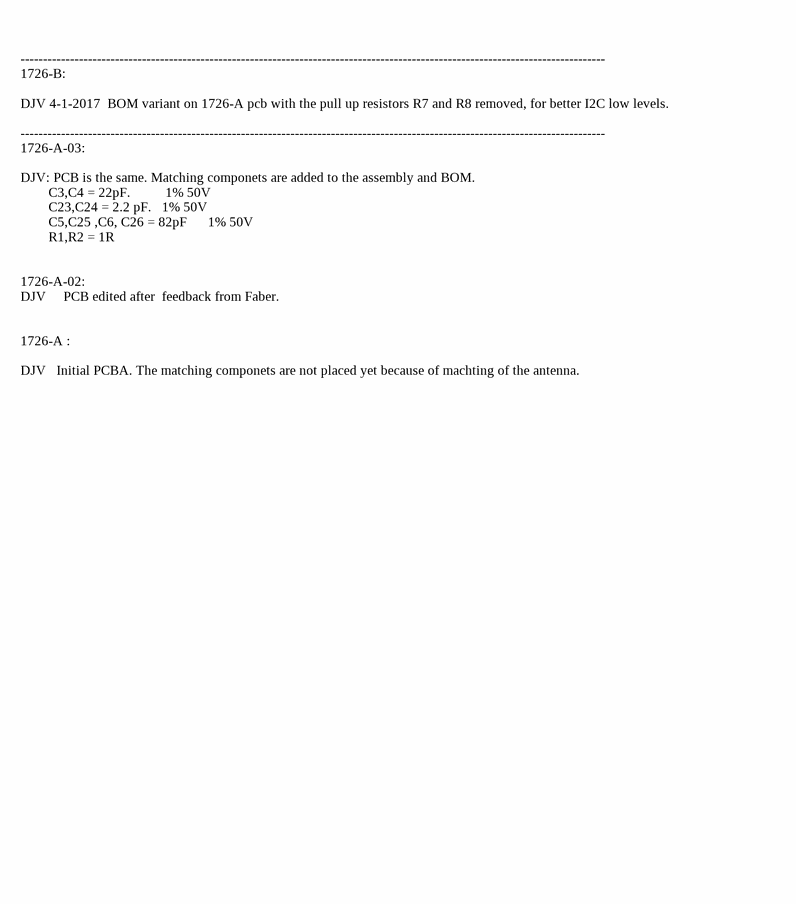
[diagram p2: RFID_PCB_Antenna_Revisions.SchDoc]

### Notes on the sheet
- ----------------------------------------------------------------------------------------------------------------------------------
  1726-B:
  DJV 4-1-2017  BOM variant on 1726-A pcb with the pull up resistors R7 and R8 removed, for better I2C low levels.
  ----------------------------------------------------------------------------------------------------------------------------------
  1726-A-03:
  DJV: PCB is the same. Matching componets are added to the assembly and BOM.
  C3,C4 = 22pF.          1% 50V
  C23,C24 = 2.2 pF.   1% 50V
  C5,C25 ,C6, C26 = 82pF      1% 50V
  R1,R2 = 1R
  1726-A-02:
  DJV     PCB edited after  feedback from Faber.
  1726-A :
  DJV   Initial PCBA. The matching componets are not placed yet because of machting of the antenna.

## Nets that join several sheets
AVDD: RFID_PCB_Antenna_Interfaces (12 pins), RFID_PCB_Antenna_Main_circuit (8 pins)
GND: RFID_PCB_Antenna_Interfaces (20 pins), RFID_PCB_Antenna_Main_circuit (25 pins)
VBAT: RFID_PCB_Antenna_Interfaces (JP7.2), RFID_PCB_Antenna_Main_circuit (U1.40)
H_REQ_3V3: RFID_PCB_Antenna_Interfaces (U4.2), RFID_PCB_Antenna_Main_circuit (U1.32)
IRQ_3V3: RFID_PCB_Antenna_Interfaces (U4.5), RFID_PCB_Antenna_Main_circuit (U1.25)
SCL_3V3: RFID_PCB_Antenna_Interfaces (R8.1 U4.4), RFID_PCB_Antenna_Main_circuit (U1.27)
SDA_3V3: RFID_PCB_Antenna_Interfaces (R7.1 U4.3), RFID_PCB_Antenna_Main_circuit (U1.28)

## Assembly variants
Not fitted parts: not fitted Fid1 Fid2 Fid3 JP2 JP3 JP5 JP7 R7 R8